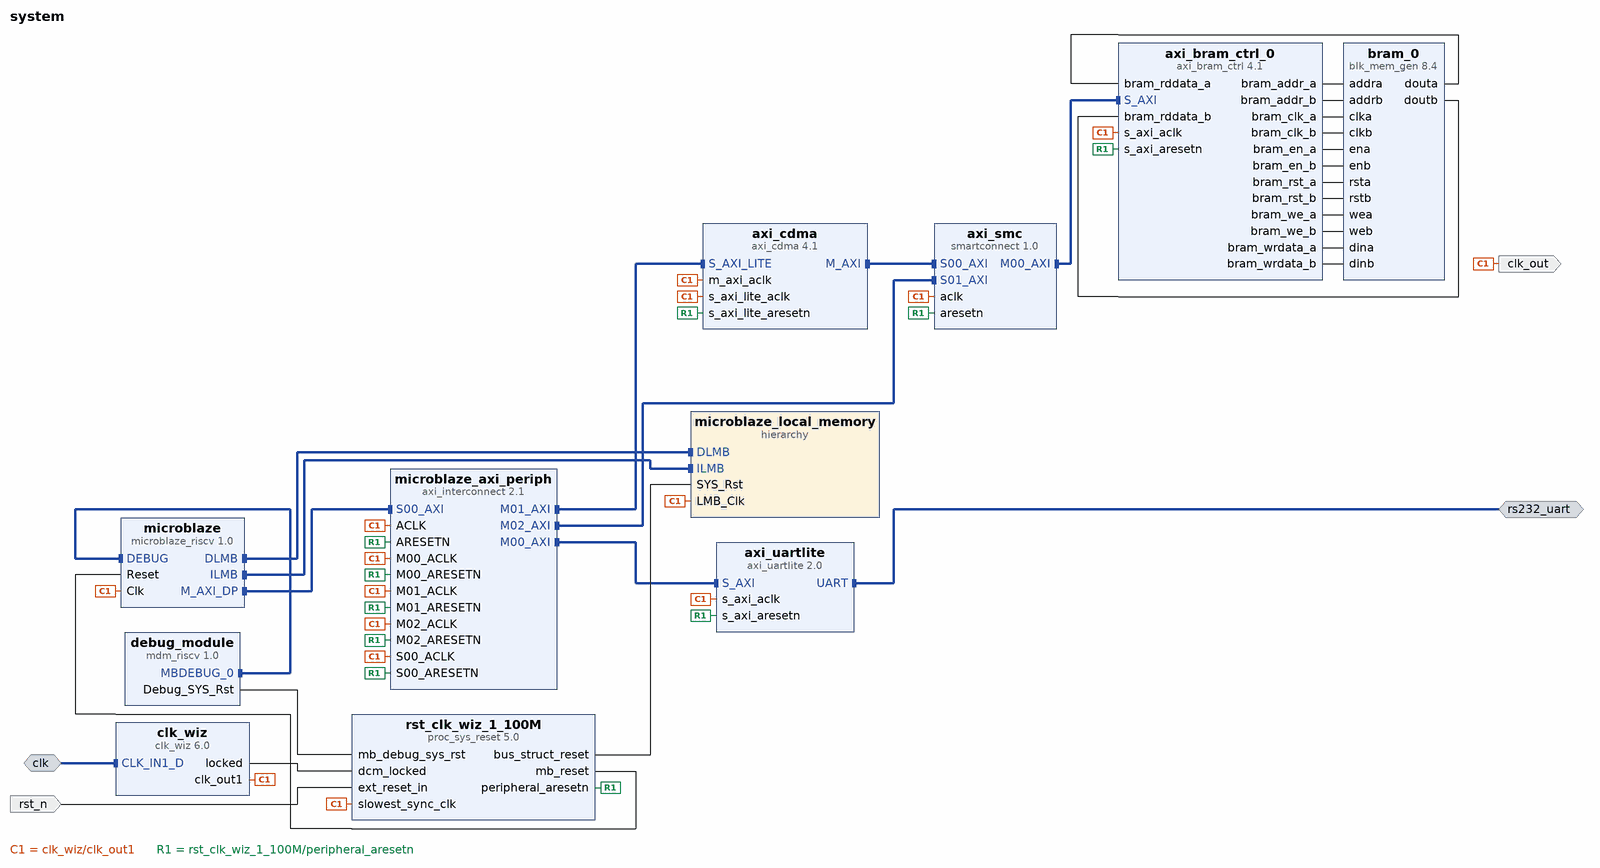
[diagram p0: block diagram of the top level]
# Vivado block design system, xcu250-figd2104-2L-e, Vivado 2024.1
create_bd_design system

create_bd_intf_port -mode Master -vlnv xilinx.com:interface:uart_rtl:1.0 rs232_uart
create_bd_intf_port -mode Slave -vlnv xilinx.com:interface:diff_clock_rtl:1.0 clk
set_property -dict {CONFIG.FREQ_HZ 300000000} [get_bd_intf_ports clk]
create_bd_port -dir I -type rst rst_n
set_property -dict {CONFIG.POLARITY ACTIVE_LOW} [get_bd_ports rst_n]
create_bd_port -dir O -type clk clk_out

create_bd_cell -type ip -vlnv xilinx.com:ip:microblaze_riscv:1.0 microblaze
set_property -dict [list \
  CONFIG.C_DEBUG_ENABLED 1 \
  CONFIG.C_D_AXI 1 \
  CONFIG.C_D_LMB 1 \
  CONFIG.C_I_LMB 1 \
  CONFIG.C_NUMBER_OF_PC_BRK 8 \
  CONFIG.C_NUMBER_OF_RD_ADDR_BRK 4 \
  CONFIG.C_NUMBER_OF_WR_ADDR_BRK 4 \
  CONFIG.G_TEMPLATE_LIST 1 \
] [get_bd_cells microblaze]
create_bd_cell -type hier microblaze_local_memory
create_bd_cell -type ip -vlnv xilinx.com:ip:mdm_riscv:1.0 debug_module
create_bd_cell -type ip -vlnv xilinx.com:ip:clk_wiz:6.0 clk_wiz
set_property -dict [list \
  CONFIG.CLKIN1_JITTER_PS 33.330000000000005 \
  CONFIG.CLKOUT1_JITTER 101.475 \
  CONFIG.CLKOUT1_PHASE_ERROR 77.836 \
  CONFIG.CLK_IN1_BOARD_INTERFACE default_300mhz_clk0 \
  CONFIG.MMCM_CLKFBOUT_MULT_F 4.000 \
  CONFIG.MMCM_CLKIN1_PERIOD 3.333 \
  CONFIG.MMCM_CLKIN2_PERIOD 10.0 \
  CONFIG.PRIM_IN_FREQ 300.000 \
  CONFIG.PRIM_SOURCE Differential_clock_capable_pin \
  CONFIG.USE_BOARD_FLOW true \
  CONFIG.USE_RESET false \
] [get_bd_cells clk_wiz]
create_bd_cell -type ip -vlnv xilinx.com:ip:proc_sys_reset:5.0 rst_clk_wiz_1_100M
set_property -dict {CONFIG.RESET_BOARD_INTERFACE resetn CONFIG.USE_BOARD_FLOW true} [get_bd_cells rst_clk_wiz_1_100M]
create_bd_cell -type ip -vlnv xilinx.com:ip:axi_uartlite:2.0 axi_uartlite
set_property -dict [list \
  CONFIG.C_BAUDRATE 115200 \
  CONFIG.UARTLITE_BOARD_INTERFACE rs232_uart \
  CONFIG.USE_BOARD_FLOW true \
] [get_bd_cells axi_uartlite]
create_bd_cell -type ip -vlnv xilinx.com:ip:axi_interconnect:2.1 microblaze_axi_periph
set_property -dict {CONFIG.NUM_MI 3 CONFIG.NUM_SI 1} [get_bd_cells microblaze_axi_periph]
create_bd_cell -type ip -vlnv xilinx.com:ip:axi_cdma:4.1 axi_cdma
set_property -dict {CONFIG.C_INCLUDE_SG 0 CONFIG.C_M_AXI_DATA_WIDTH 512 CONFIG.C_M_AXI_MAX_BURST_LEN 8} [get_bd_cells axi_cdma]
create_bd_cell -type ip -vlnv xilinx.com:ip:axi_bram_ctrl:4.1 axi_bram_ctrl_0
set_property -dict {CONFIG.DATA_WIDTH 512} [get_bd_cells axi_bram_ctrl_0]
create_bd_cell -type ip -vlnv xilinx.com:ip:blk_mem_gen:8.4 bram_0
set_property -dict [list \
  CONFIG.Coe_File bram_init.coe \
  CONFIG.EN_SAFETY_CKT false \
  CONFIG.Enable_32bit_Address true \
  CONFIG.Fill_Remaining_Memory_Locations true \
  CONFIG.Load_Init_File true \
  CONFIG.Memory_Type True_Dual_Port_RAM \
  CONFIG.Remaining_Memory_Locations babecafe \
  CONFIG.Write_Width_A 512 \
  CONFIG.use_bram_block Stand_Alone \
] [get_bd_cells bram_0]
create_bd_cell -type ip -vlnv xilinx.com:ip:smartconnect:1.0 axi_smc
set_property -dict {CONFIG.NUM_SI 2} [get_bd_cells axi_smc]

# ---- hierarchy /microblaze_local_memory ----
current_bd_instance /microblaze_local_memory
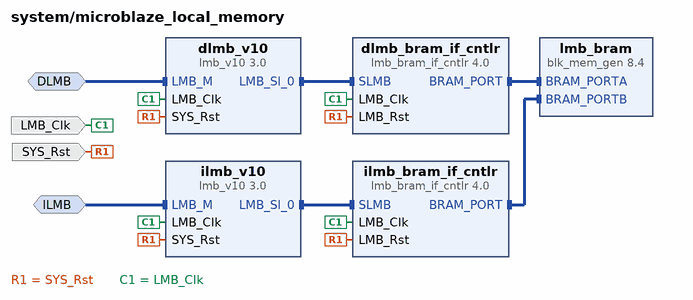
[diagram p1: block diagram inside /microblaze_local_memory]
create_bd_intf_pin -mode MirroredMaster -vlnv xilinx.com:interface:lmb_rtl:1.0 DLMB
create_bd_intf_pin -mode MirroredMaster -vlnv xilinx.com:interface:lmb_rtl:1.0 ILMB
create_bd_pin -dir I -type clk LMB_Clk
create_bd_pin -dir I -type rst SYS_Rst

create_bd_cell -type ip -vlnv xilinx.com:ip:lmb_v10:3.0 dlmb_v10
create_bd_cell -type ip -vlnv xilinx.com:ip:lmb_v10:3.0 ilmb_v10
create_bd_cell -type ip -vlnv xilinx.com:ip:lmb_bram_if_cntlr:4.0 dlmb_bram_if_cntlr
set_property -dict {CONFIG.C_ECC 0} [get_bd_cells dlmb_bram_if_cntlr]
create_bd_cell -type ip -vlnv xilinx.com:ip:lmb_bram_if_cntlr:4.0 ilmb_bram_if_cntlr
set_property -dict {CONFIG.C_ECC 0} [get_bd_cells ilmb_bram_if_cntlr]
create_bd_cell -type ip -vlnv xilinx.com:ip:blk_mem_gen:8.4 lmb_bram
set_property -dict {CONFIG.Memory_Type True_Dual_Port_RAM CONFIG.use_bram_block BRAM_Controller} [get_bd_cells lmb_bram]

# ---- connections ----

current_bd_instance /microblaze_local_memory
connect_bd_intf_net -intf_net microblaze_riscv_0_dlmb [get_bd_intf_pins dlmb_v10/LMB_M] [get_bd_intf_pins DLMB]
connect_bd_intf_net -intf_net microblaze_riscv_0_dlmb_bus [get_bd_intf_pins dlmb_v10/LMB_Sl_0] [get_bd_intf_pins dlmb_bram_if_cntlr/SLMB]
connect_bd_intf_net -intf_net microblaze_riscv_0_dlmb_cntlr [get_bd_intf_pins dlmb_bram_if_cntlr/BRAM_PORT] [get_bd_intf_pins lmb_bram/BRAM_PORTA]
connect_bd_intf_net -intf_net microblaze_riscv_0_ilmb [get_bd_intf_pins ilmb_v10/LMB_M] [get_bd_intf_pins ILMB]
connect_bd_intf_net -intf_net microblaze_riscv_0_ilmb_bus [get_bd_intf_pins ilmb_v10/LMB_Sl_0] [get_bd_intf_pins ilmb_bram_if_cntlr/SLMB]
connect_bd_intf_net -intf_net microblaze_riscv_0_ilmb_cntlr [get_bd_intf_pins ilmb_bram_if_cntlr/BRAM_PORT] [get_bd_intf_pins lmb_bram/BRAM_PORTB]
connect_bd_net [get_bd_pins SYS_Rst] \
  [get_bd_pins dlmb_v10/SYS_Rst] [get_bd_pins dlmb_bram_if_cntlr/LMB_Rst] [get_bd_pins ilmb_v10/SYS_Rst] \
  [get_bd_pins ilmb_bram_if_cntlr/LMB_Rst]
connect_bd_net -net microblaze_riscv_0_Clk [get_bd_pins LMB_Clk] \
  [get_bd_pins dlmb_v10/LMB_Clk] [get_bd_pins dlmb_bram_if_cntlr/LMB_Clk] [get_bd_pins ilmb_v10/LMB_Clk] \
  [get_bd_pins ilmb_bram_if_cntlr/LMB_Clk]
set_property HDL_ATTRIBUTE.BMM_INFO_ADDRESS_SPACE {byte  0x00000000 32 > system microblaze_local_memory/lmb_bram} [get_bd_cells dlmb_bram_if_cntlr]
set_property HDL_ATTRIBUTE.KEEP_HIERARCHY yes [get_bd_cells dlmb_bram_if_cntlr]

current_bd_instance /
connect_bd_intf_net -intf_net axi_cdma_0_M_AXI [get_bd_intf_pins axi_cdma/M_AXI] [get_bd_intf_pins axi_smc/S00_AXI]
connect_bd_intf_net [get_bd_intf_pins axi_smc/M00_AXI] [get_bd_intf_pins axi_bram_ctrl_0/S_AXI]
connect_bd_intf_net -intf_net axi_uartlite_0_UART [get_bd_intf_ports rs232_uart] [get_bd_intf_pins axi_uartlite/UART]
connect_bd_intf_net -intf_net default_300mhz_clk0_1 [get_bd_intf_ports clk] [get_bd_intf_pins clk_wiz/CLK_IN1_D]
connect_bd_intf_net -intf_net microblaze_riscv_0_M_AXI_DP [get_bd_intf_pins microblaze/M_AXI_DP] [get_bd_intf_pins microblaze_axi_periph/S00_AXI]
connect_bd_intf_net [get_bd_intf_pins microblaze_axi_periph/M00_AXI] [get_bd_intf_pins axi_uartlite/S_AXI]
connect_bd_intf_net [get_bd_intf_pins microblaze_axi_periph/M01_AXI] [get_bd_intf_pins axi_cdma/S_AXI_LITE]
connect_bd_intf_net [get_bd_intf_pins microblaze_axi_periph/M02_AXI] [get_bd_intf_pins axi_smc/S01_AXI]
connect_bd_intf_net -intf_net microblaze_riscv_0_debug [get_bd_intf_pins debug_module/MBDEBUG_0] [get_bd_intf_pins microblaze/DEBUG]
connect_bd_intf_net -intf_net microblaze_riscv_0_dlmb_1 [get_bd_intf_pins microblaze/DLMB] [get_bd_intf_pins microblaze_local_memory/DLMB]
connect_bd_intf_net -intf_net microblaze_riscv_0_ilmb_1 [get_bd_intf_pins microblaze/ILMB] [get_bd_intf_pins microblaze_local_memory/ILMB]
connect_bd_net [get_bd_pins axi_bram_ctrl_0/bram_addr_a] [get_bd_pins bram_0/addra]
connect_bd_net [get_bd_pins axi_bram_ctrl_0/bram_addr_b] [get_bd_pins bram_0/addrb]
connect_bd_net [get_bd_pins axi_bram_ctrl_0/bram_clk_a] [get_bd_pins bram_0/clka]
connect_bd_net [get_bd_pins axi_bram_ctrl_0/bram_clk_b] [get_bd_pins bram_0/clkb]
connect_bd_net -net axi_bram_ctrl_0_bram_douta [get_bd_pins bram_0/douta] [get_bd_pins axi_bram_ctrl_0/bram_rddata_a]
connect_bd_net -net axi_bram_ctrl_0_bram_doutb [get_bd_pins bram_0/doutb] [get_bd_pins axi_bram_ctrl_0/bram_rddata_b]
connect_bd_net [get_bd_pins axi_bram_ctrl_0/bram_en_a] [get_bd_pins bram_0/ena]
connect_bd_net [get_bd_pins axi_bram_ctrl_0/bram_en_b] [get_bd_pins bram_0/enb]
connect_bd_net [get_bd_pins axi_bram_ctrl_0/bram_rst_a] [get_bd_pins bram_0/rsta]
connect_bd_net [get_bd_pins axi_bram_ctrl_0/bram_rst_b] [get_bd_pins bram_0/rstb]
connect_bd_net [get_bd_pins axi_bram_ctrl_0/bram_we_a] [get_bd_pins bram_0/wea]
connect_bd_net [get_bd_pins axi_bram_ctrl_0/bram_we_b] [get_bd_pins bram_0/web]
connect_bd_net [get_bd_pins axi_bram_ctrl_0/bram_wrdata_a] [get_bd_pins bram_0/dina]
connect_bd_net [get_bd_pins axi_bram_ctrl_0/bram_wrdata_b] [get_bd_pins bram_0/dinb]
connect_bd_net -net clk_wiz_1_clk_out1 [get_bd_pins clk_wiz/clk_out1] \
  [get_bd_ports clk_out] [get_bd_pins microblaze/Clk] [get_bd_pins microblaze_local_memory/LMB_Clk] \
  [get_bd_pins rst_clk_wiz_1_100M/slowest_sync_clk] [get_bd_pins microblaze_axi_periph/ACLK] \
  [get_bd_pins microblaze_axi_periph/S00_ACLK] [get_bd_pins axi_uartlite/s_axi_aclk] \
  [get_bd_pins microblaze_axi_periph/M00_ACLK] [get_bd_pins axi_cdma/s_axi_lite_aclk] \
  [get_bd_pins microblaze_axi_periph/M01_ACLK] [get_bd_pins axi_cdma/m_axi_aclk] [get_bd_pins axi_smc/aclk] \
  [get_bd_pins axi_bram_ctrl_0/s_axi_aclk] [get_bd_pins microblaze_axi_periph/M02_ACLK]
connect_bd_net -net clk_wiz_1_locked [get_bd_pins clk_wiz/locked] [get_bd_pins rst_clk_wiz_1_100M/dcm_locked]
connect_bd_net -net mdm_1_debug_sys_rst [get_bd_pins debug_module/Debug_SYS_Rst] [get_bd_pins rst_clk_wiz_1_100M/mb_debug_sys_rst]
connect_bd_net -net resetn_1 [get_bd_ports rst_n] [get_bd_pins rst_clk_wiz_1_100M/ext_reset_in]
connect_bd_net [get_bd_pins rst_clk_wiz_1_100M/bus_struct_reset] [get_bd_pins microblaze_local_memory/SYS_Rst]
connect_bd_net [get_bd_pins rst_clk_wiz_1_100M/mb_reset] [get_bd_pins microblaze/Reset]
connect_bd_net [get_bd_pins rst_clk_wiz_1_100M/peripheral_aresetn] \
  [get_bd_pins microblaze_axi_periph/S00_ARESETN] [get_bd_pins axi_uartlite/s_axi_aresetn] \
  [get_bd_pins microblaze_axi_periph/M00_ARESETN] [get_bd_pins microblaze_axi_periph/ARESETN] \
  [get_bd_pins axi_cdma/s_axi_lite_aresetn] [get_bd_pins microblaze_axi_periph/M01_ARESETN] \
  [get_bd_pins axi_bram_ctrl_0/s_axi_aresetn] [get_bd_pins axi_smc/aresetn] [get_bd_pins microblaze_axi_periph/M02_ARESETN]
set_property HDL_ATTRIBUTE.BMM_INFO_PROCESSOR {riscv > system microblaze_local_memory/dlmb_bram_if_cntlr} [get_bd_cells microblaze]
set_property HDL_ATTRIBUTE.KEEP_HIERARCHY yes [get_bd_cells microblaze]

# ---- address map ----
assign_bd_address -offset 0xC0000000 -range 8K -target_address_space [get_bd_addr_spaces axi_cdma/Data] [get_bd_addr_segs axi_bram_ctrl_0/S_AXI/Mem0]
assign_bd_address -offset 0x00000000 -range 16K -target_address_space [get_bd_addr_spaces microblaze/Data] [get_bd_addr_segs microblaze_local_memory/dlmb_bram_if_cntlr/SLMB/Mem]
assign_bd_address -offset 0x40600000 -range 64K -target_address_space [get_bd_addr_spaces microblaze/Data] [get_bd_addr_segs axi_uartlite/S_AXI/Reg]
assign_bd_address -offset 0x44A00000 -range 64K -target_address_space [get_bd_addr_spaces microblaze/Data] [get_bd_addr_segs axi_cdma/S_AXI_LITE/Reg]
assign_bd_address -offset 0xC0000000 -range 8K -target_address_space [get_bd_addr_spaces microblaze/Data] [get_bd_addr_segs axi_bram_ctrl_0/S_AXI/Mem0]
assign_bd_address -offset 0x00000000 -range 16K -target_address_space [get_bd_addr_spaces microblaze/Instruction] [get_bd_addr_segs microblaze_local_memory/ilmb_bram_if_cntlr/SLMB/Mem]

validate_bd_design
save_bd_design
